# Altium schematic sheet Battery and ANT.SchDoc
size A4
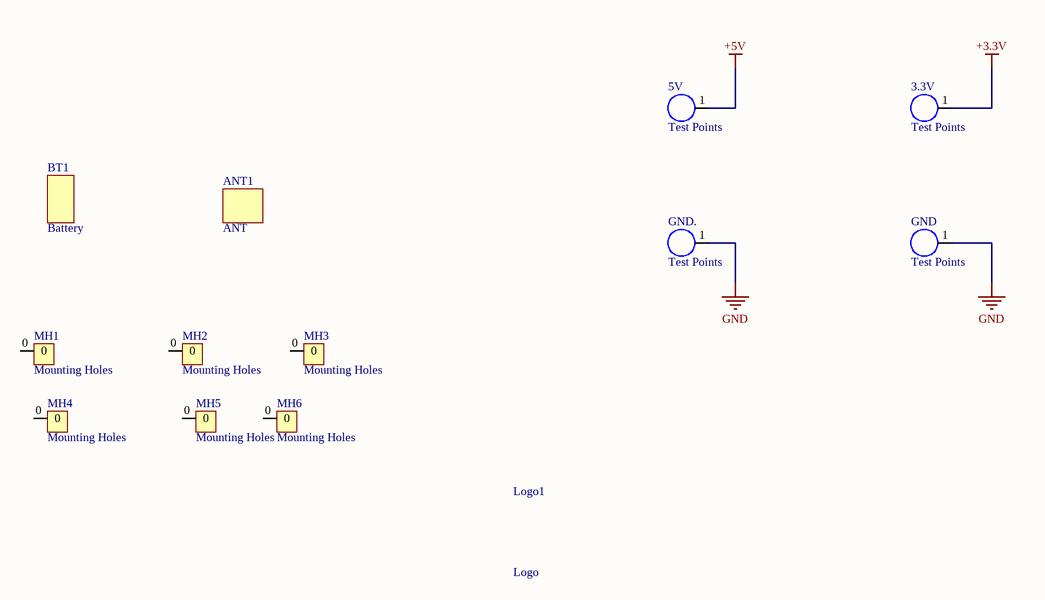
[diagram p0: Battery and ANT.SchDoc]

## Parts
3.3V  Test Points  [Test Points]
5V  Test Points  [Test Points]
ANT1  ANT  [RFID_ANT]
BT1  Battery  [Lipo_Battery]
GND  Test Points  [Test Points]
GND.  Test Points  [Test Points]
Logo1  Logo  [Logo]
MH1  Mounting Holes  [PCBComponent_1]
MH2  Mounting Holes  [PCBComponent_1]
MH3  Mounting Holes  [PCBComponent_1]
MH4  Mounting Holes  [PCBComponent_1]
MH5  Mounting Holes  [PCBComponent_1]
MH6  Mounting Holes  [PCBComponent_1]

## Nets
+3.3V: 3.3V.1
+5V: 5V.1
GND: GND.1 GND..1

Not connected (* = marked no-connect by the designer): MH1 0; MH2 0; MH3 0; MH4 0; MH5 0; MH6 0